# EAGLE design transmitter_with_ST7920_LCD (EAGLE 7.7.0)
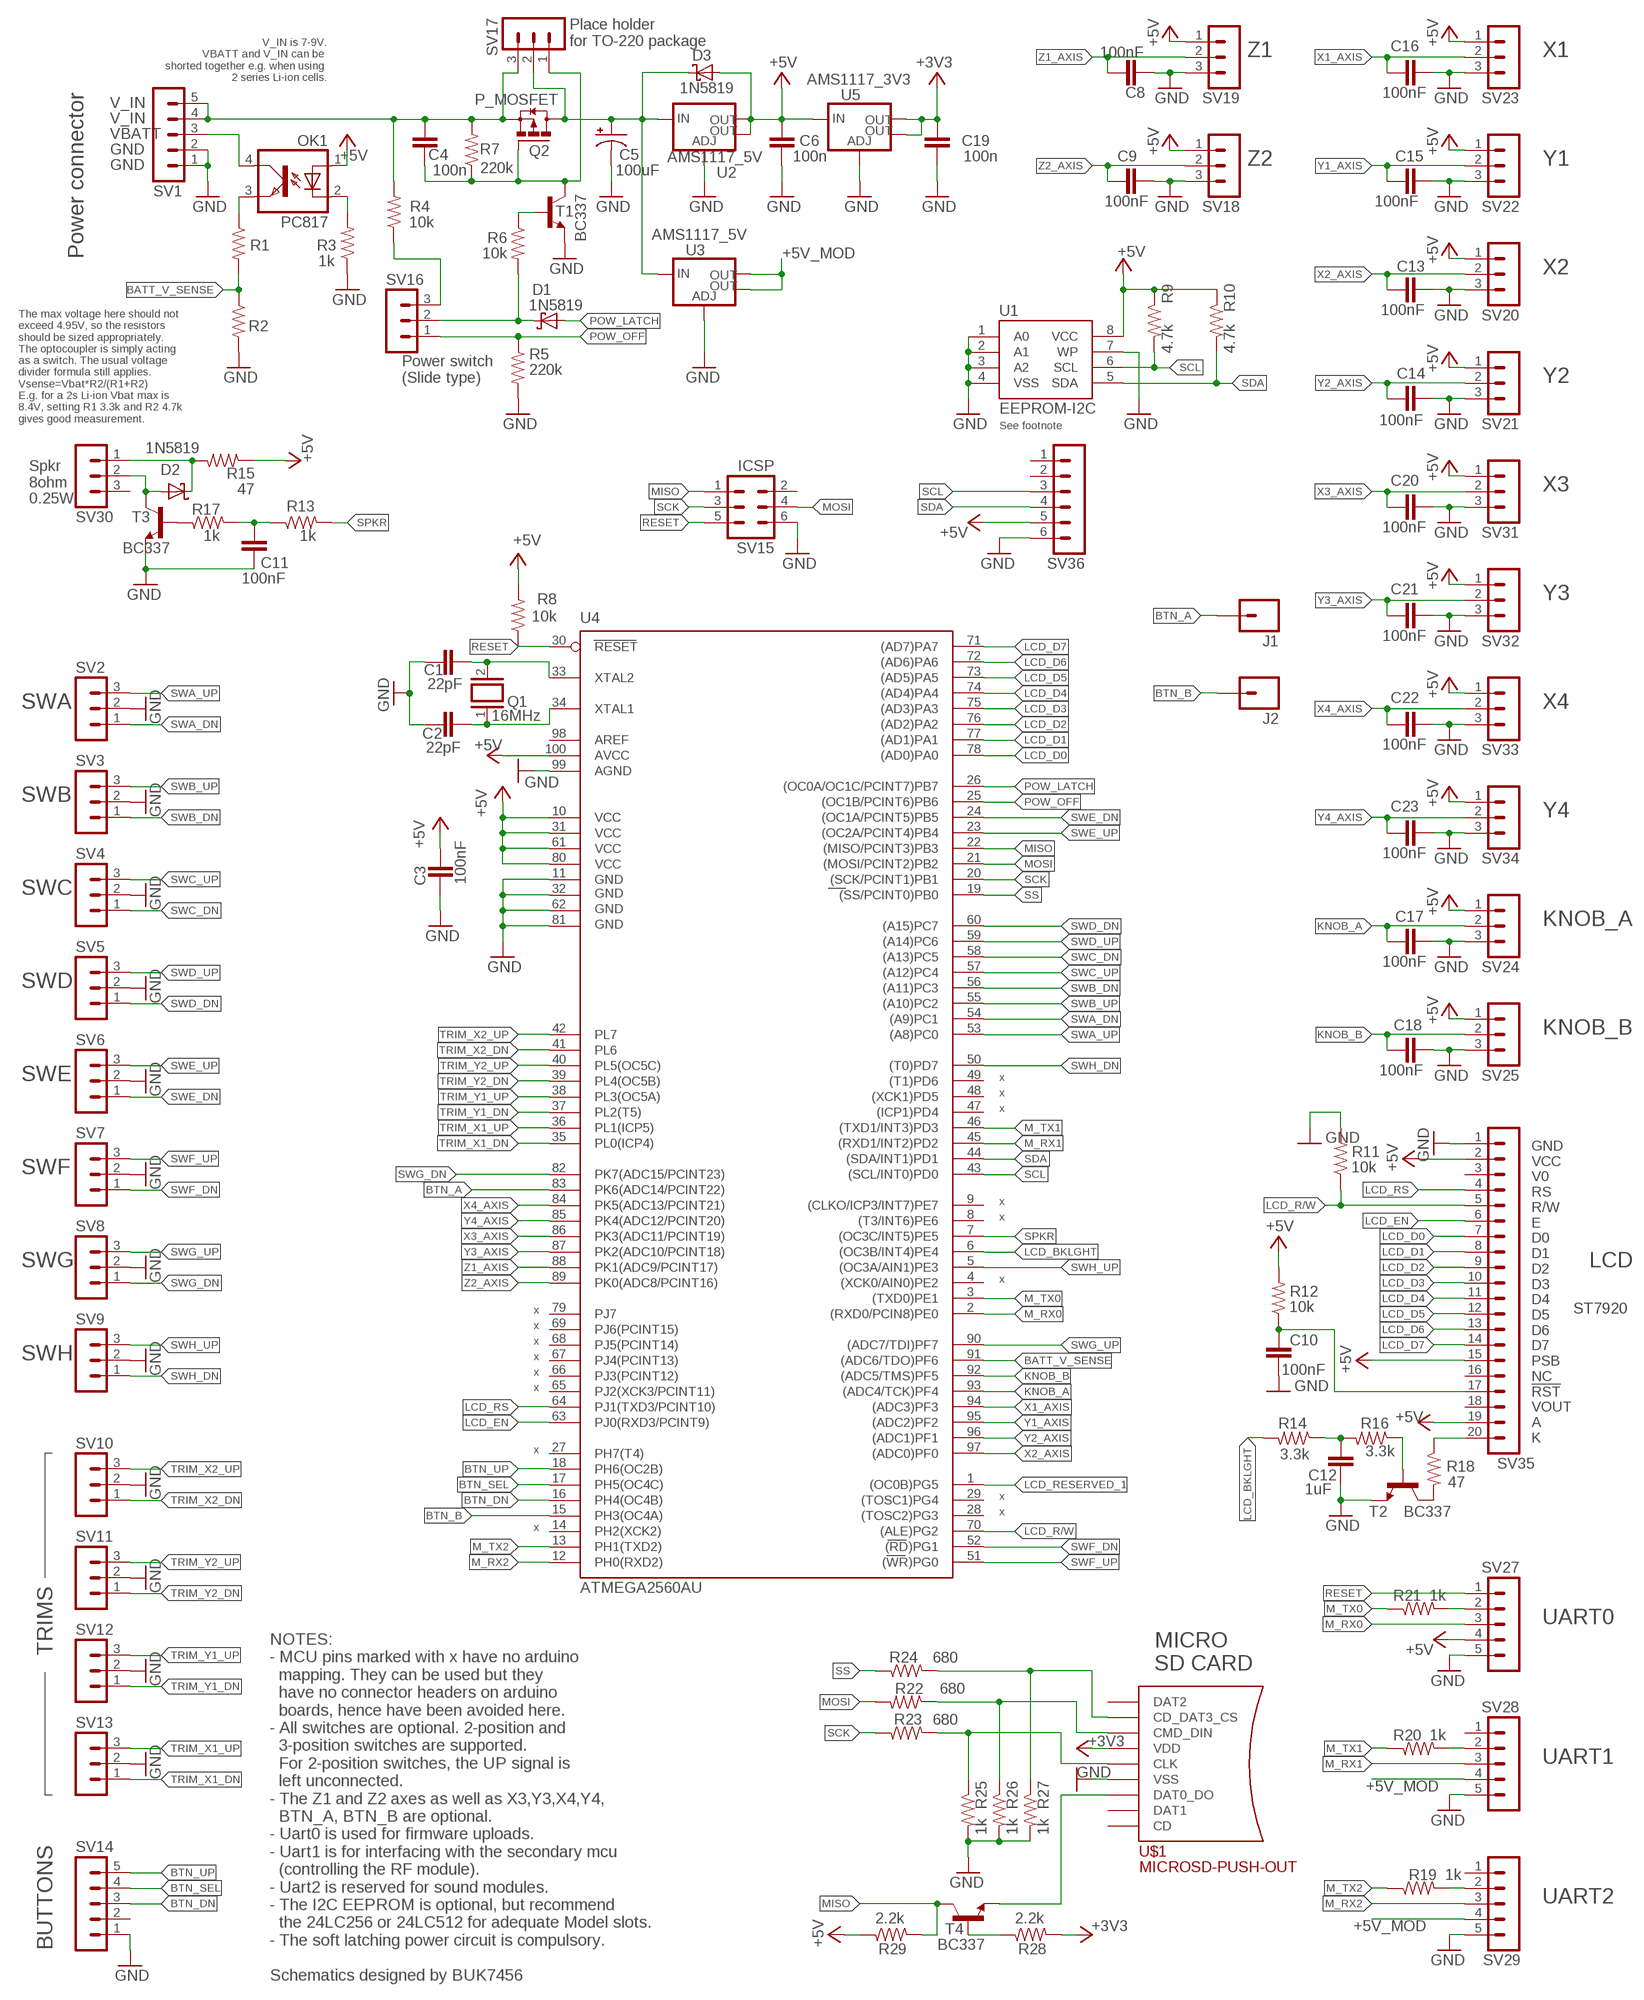
[diagram p0: schematic, sheet 1]

## Parts
C1  22pF  C-EU050-024X044  [C050-024X044]
C2  22pF  C-EU050-024X044  [C050-024X044]
C3  100nF  C-EU050-024X044  [C050-024X044]
C4  100n  C-EU050-024X044  [C050-024X044]
C5  100uF  CPOL-USE2,5-6E  [E2,5-6E]
C6  100n  C-EU050-024X044  [C050-024X044]
C8  100nF  C-EU050-024X044  [C050-024X044]
C9  100nF  C-EU050-024X044  [C050-024X044]
C10  100nF  C-EU050-024X044  [C050-024X044]
C11  100nF  C-EU050-024X044  [C050-024X044]
C12  1uF  C-EU050-024X044  [C050-024X044]
C13  100nF  C-EU050-024X044  [C050-024X044]
C14  100nF  C-EU050-024X044  [C050-024X044]
C15  100nF  C-EU050-024X044  [C050-024X044]
C16  100nF  C-EU050-024X044  [C050-024X044]
C17  100nF  C-EU050-024X044  [C050-024X044]
C18  100nF  C-EU050-024X044  [C050-024X044]
C19  100n  C-EU050-024X044  [C050-024X044]
C20  100nF  C-EU050-024X044  [C050-024X044]
C21  100nF  C-EU050-024X044  [C050-024X044]
C22  100nF  C-EU050-024X044  [C050-024X044]
C23  100nF  C-EU050-024X044  [C050-024X044]
D1  1N5819  1N5817-B  [DO41-7.6]
D2  1N5819  1N5817-B  [DO41-7.6]
D3  1N5819  1N5817-B  [DO41-7.6]
J1  M01PTH_LONGPAD  [1X01_LONGPAD]
J2  M01PTH_LONGPAD  [1X01_LONGPAD]
OK1  PC817  [DIL04]
Q1  16MHz  XTAL/S  [QS]
Q2  P_MOSFET  FDN360P  [SUPER-SOT3]
R1  1k  R-US_0204/5  [0204/5]
R2  1k  R-US_0204/5  [0204/5]
R3  1k  R-US_0204/5  [0204/5]
R4  10k  R-US_0204/5  [0204/5]
R5  220k  R-US_0204/5  [0204/5]
R6  10k  R-US_0204/5  [0204/5]
R7  220k  R-US_0204/5  [0204/5]
R8  10k  R-US_0204/5  [0204/5]
R9  4.7k  R-US_0204/5  [0204/5]
R10  4.7k  R-US_0204/5  [0204/5]
R11  10k  R-US_0204/5  [0204/5]
R12  10k  R-US_0204/5  [0204/5]
R13  1k  R-US_0204/5  [0204/5]
R14  3.3k  R-US_0204/5  [0204/5]
R15  47  R-US_0204/5  [0204/5]
R16  3.3k  R-US_0204/5  [0204/5]
R17  1k  R-US_0204/5  [0204/5]
R18  47  R-US_0204/5  [0204/5]
R19  1k  R-US_0204/5  [0204/5]
R20  1k  R-US_0204/5  [0204/5]
R21  1k  R-US_0204/5  [0204/5]
R22  680  R-US_0204/5  [0204/5]
R23  680  R-US_0204/5  [0204/5]
R24  680  R-US_0204/5  [0204/5]
R25  1k  R-US_0204/5  [0204/5]
R26  1k  R-US_0204/5  [0204/5]
R27  1k  R-US_0204/5  [0204/5]
R28  2.2k  R-US_0204/5  [0204/5]
R29  2.2k  R-US_0204/5  [0204/5]
SV1  MA05-1  [MA05-1]
SV2  MA03-1  [MA03-1]
SV3  MA03-1  [MA03-1]
SV4  MA03-1  [MA03-1]
SV5  MA03-1  [MA03-1]
SV6  MA03-1  [MA03-1]
SV7  MA03-1  [MA03-1]
SV8  MA03-1  [MA03-1]
SV9  MA03-1  [MA03-1]
SV10  MA03-1  [MA03-1]
SV11  MA03-1  [MA03-1]
SV12  MA03-1  [MA03-1]
SV13  MA03-1  [MA03-1]
SV14  MA05-1  [MA05-1]
SV15  ICSP  MA03-2  [MA03-2]
SV16  MA03-1  [MA03-1]
SV17  MA03-1  [MA03-1]
SV18  MA03-1  [MA03-1]
SV19  MA03-1  [MA03-1]
SV20  MA03-1  [MA03-1]
SV21  MA03-1  [MA03-1]
SV22  MA03-1  [MA03-1]
SV23  MA03-1  [MA03-1]
SV24  MA03-1  [MA03-1]
SV25  MA03-1  [MA03-1]
SV27  MA05-1  [MA05-1]
SV28  MA05-1  [MA05-1]
SV29  MA05-1  [MA05-1]
SV30  MA03-1  [MA03-1]
SV31  MA03-1  [MA03-1]
SV32  MA03-1  [MA03-1]
SV33  MA03-1  [MA03-1]
SV34  MA03-1  [MA03-1]
SV35  MA20-1  [MA20-1]
SV36  MA06-1  [MA06-1]
T1  BC337  [TO92]
T2  BC337  [TO92]
T3  BC337  [TO92]
T4  BC337  [TO92]
U1  EEPROM-I2C  EEPROM-I2CEIAJ  [SO08-EIAJ]
U2  AMS1117_5V  V_REG_LM1117SOT223  [SOT223]
U3  AMS1117_5V  V_REG_LM1117SOT223  [SOT223]
U4  ATMEGA2560AU  [TQFP100]
U5  AMS1117_3V3  V_REG_LM1117SOT223  [SOT223]
U$1  MICROSD-PUSH-OUT  [MICROSD-PUSH-OUT]

## Nets
+3V3: C19.2 R28.2 U5.2(OUT) U5.4(OUT) U$1.4(VDD)
+5V: C3.1 C6.2 D3.A OK1.1(A) R8.2 R9.1 R10.1 R12.2 R15.1 R29.1 SV18.1 SV19.1 SV20.1 SV21.1 SV22.1 SV23.1 SV24.1 SV25.1 SV27.4 SV31.1 SV32.1 SV33.1 SV34.1 SV35.2 SV35.15 SV35.19 SV36.5 U1.8(VCC) U2.2(OUT) U2.4(OUT) U4.10(VCC) U4.31(VCC1) U4.61(VCC2) U4.80(VCC3) U4.100(AVCC) U5.3(IN)
+5V_MOD: SV28.4 SV29.4 U3.2(OUT) U3.4(OUT)
BATT_V_SENSE: R1.2 R2.1 U4.91((ADC6/TDO)PF6)
BTN_A: J1.1 U4.83(PK6(ADC14/PCINT22))
BTN_B: J2.1 U4.15(PH3(OC4A))
BTN_DN: SV14.3 U4.16(PH4(OC4B))
BTN_SEL: SV14.4 U4.17(PH5(OC4C))
BTN_UP: SV14.5 U4.18(PH6(OC2B))
GND: C1.1 C2.1 C3.2 C5.- C6.1 C8.2 C9.1 C10.2 C11.2 C12.2 C13.1 C14.1 C15.1 C16.1 C17.1 C18.1 C19.1 C20.1 C21.1 C22.1 C23.1 R2.2 R3.1 R5.2 R11.2 R25.2 R26.2 R27.2 SV1.1 SV1.2 SV2.2 SV3.2 SV4.2 SV5.2 SV6.2 SV7.2 SV8.2 SV9.2 SV10.2 SV11.2 SV12.2 SV13.2 SV14.1 SV15.6 SV18.3 SV19.3 SV20.3 SV21.3 SV22.3 SV23.3 SV24.3 SV25.3 SV27.5 SV28.5 SV29.5 SV31.3 SV32.3 SV33.3 SV34.3 SV35.1 SV36.6 T1.1(E) T2.1(E) T3.1(E) U1.1(A0) U1.2(A1) U1.3(A2) U1.4(VSS) U1.7(WP) U2.1(ADJ) U3.1(ADJ) U4.11(GND) U4.32(GND1) U4.62(GND2) U4.81(GND3) U4.99(AGND) U5.1(ADJ) U$1.6(VSS) U$1.G1(VSS) U$1.G2(VSS) U$1.G3(VSS) U$1.G4(VSS)
KNOB_A: C17.2 SV24.2 U4.93((ADC4/TCK)PF4)
KNOB_B: C18.2 SV25.2 U4.92((ADC5/TMS)PF5)
LCD_BKLGHT: R14.2 U4.6((OC3B/INT4)PE4)
LCD_D0: SV35.7 U4.78((AD0)PA0)
LCD_D1: SV35.8 U4.77((AD1)PA1)
LCD_D2: SV35.9 U4.76((AD2)PA2)
LCD_D3: SV35.10 U4.75((AD3)PA3)
LCD_D4: SV35.11 U4.74((AD4)PA4)
LCD_D5: SV35.12 U4.73((AD5)PA5)
LCD_D6: SV35.13 U4.72((AD6)PA6)
LCD_D7: SV35.14 U4.71((AD7)PA7)
LCD_EN: SV35.6 U4.63(PJ0(RXD3/PCINT9))
LCD_R/W: R11.1 SV35.5 U4.70((ALE)PG2)
LCD_RESERVED_1: U4.1((OC0B)PG5)
LCD_RS: SV35.4 U4.64(PJ1(TXD3/PCINT10))
M_RX0: SV27.3 U4.2((RXD0/PCIN8)PE0)
M_RX1: SV28.3 U4.45((RXD1/INT2)PD2)
M_RX2: SV29.3 U4.12(PH0(RXD2))
M_TX0: R21.1 U4.3((TXD0)PE1)
M_TX1: R20.1 U4.46((TXD1/INT3)PD3)
M_TX2: R19.1 U4.13(PH1(TXD2))
MISO: R29.2 SV15.1 T4.3(C) U4.22((MISO/PCINT3)PB3)
MOSI: R22.2 SV15.4 U4.21((MOSI/PCINT2)PB2)
N$1: C12.1 R14.1 R16.2
N$2: C10.1 R12.1 SV35.17
N$3: R18.2 T2.3(C)
N$4: R16.1 T2.2(B)
N$5: C11.1 R13.1 R17.2
N$6: R21.2 SV27.2
N$7: R20.2 SV28.2
N$8: R19.2 SV29.2
N$9: C1.2 Q1.2 U4.33(XTAL2)
N$10: C2.2 Q1.1 U4.34(XTAL1)
N$11: T4.1(E) U$1.7(DAT0_DO)
N$12: OK1.4(COL) SV1.3
N$15: R18.1 SV35.20
N$16: R24.2 R27.1 U$1.2(CD_DAT3_CS)
N$17: R22.1 R26.1 U$1.3(CMD_DIN)
N$18: R23.2 R25.1 U$1.5(CLK)
N$19: R28.1 T4.2(B)
N$20: R17.1 T3.2(B)
N$21: D2.A SV30.2 T3.3(C)
N$22: D2.C R15.2 SV30.1
N$29: R6.1 T1.2(B)
N$30: D1.C R6.2 SV16.2
N$38: OK1.3(EMIT) R1.1
N$39: C4.2 Q2.2(S) R4.2 R7.2 SV1.4 SV1.5 SV17.3
N$43: C4.1 Q2.1(G) R7.1 SV17.1 T1.3(C)
N$44: OK1.2(C) R3.2
N$45: R4.1 SV16.3
N$47: C5.+ D3.C Q2.3(D) SV17.2 U2.3(IN) U3.3(IN)
POW_LATCH: D1.A U4.26((OC0A/OC1C/PCINT7)PB7)
POW_OFF: R5.1 SV16.1 U4.25((OC1B/PCINT6)PB6)
RESET: R8.1 SV15.5 SV27.1 U4.30(RESET)
SCK: R23.1 SV15.3 U4.20((SCK/PCINT1)PB1)
SCL: R9.2 SV36.3 U1.6(SCL) U4.43((SCL/INT0)PD0)
SDA: R10.2 SV36.4 U1.5(SDA) U4.44((SDA/INT1)PD1)
SPKR: R13.2 U4.7((OC3C/INT5)PE5)
SS: R24.1 U4.19((SS/PCINT0)PB0)
SWA_DN: SV2.1 U4.54((A9)PC1)
SWA_UP: SV2.3 U4.53((A8)PC0)
SWB_DN: SV3.1 U4.56((A11)PC3)
SWB_UP: SV3.3 U4.55((A10)PC2)
SWC_DN: SV4.1 U4.58((A13)PC5)
SWC_UP: SV4.3 U4.57((A12)PC4)
SWD_DN: SV5.1 U4.60((A15)PC7)
SWD_UP: SV5.3 U4.59((A14)PC6)
SWE_DN: SV6.1 U4.24((OC1A/PCINT5)PB5)
SWE_UP: SV6.3 U4.23((OC2A/PCINT4)PB4)
SWF_DN: SV7.1 U4.52((RD)PG1)
SWF_UP: SV7.3 U4.51((WR)PG0)
SWG_DN: SV8.1 U4.82(PK7(ADC15/PCINT23))
SWG_UP: SV8.3 U4.90((ADC7/TDI)PF7)
SWH_DN: SV9.1 U4.50((T0)PD7)
SWH_UP: SV9.3 U4.5((OC3A/AIN1)PE3)
TRIM_X1_DN: SV13.1 U4.35(PL0(ICP4))
TRIM_X1_UP: SV13.3 U4.36(PL1(ICP5))
TRIM_X2_DN: SV10.1 U4.41(PL6)
TRIM_X2_UP: SV10.3 U4.42(PL7)
TRIM_Y1_DN: SV12.1 U4.37(PL2(T5))
TRIM_Y1_UP: SV12.3 U4.38(PL3(OC5A))
TRIM_Y2_DN: SV11.1 U4.39(PL4(OC5B))
TRIM_Y2_UP: SV11.3 U4.40(PL5(OC5C))
X1_AXIS: C16.2 SV23.2 U4.94((ADC3)PF3)
X2_AXIS: C13.2 SV20.2 U4.97((ADC0)PF0)
X3_AXIS: C20.2 SV31.2 U4.86(PK3(ADC11/PCINT19))
X4_AXIS: C22.2 SV33.2 U4.84(PK5(ADC13/PCINT21))
Y1_AXIS: C15.2 SV22.2 U4.95((ADC2)PF2)
Y2_AXIS: C14.2 SV21.2 U4.96((ADC1)PF1)
Y3_AXIS: C21.2 SV32.2 U4.87(PK2(ADC10/PCINT18))
Y4_AXIS: C23.2 SV34.2 U4.85(PK4(ADC12/PCINT20))
Z1_AXIS: C8.1 SV19.2 U4.88(PK1(ADC9/PCINT17))
Z2_AXIS: C9.2 SV18.2 U4.89(PK0(ADC8/PCINT16))
Unconnected: SV14.2 SV15.2 SV28.1 SV29.1 SV30.3 SV35.3 SV35.16 SV35.18 SV36.1 SV36.2 U4.4((XCK0/AIN0)PE2) U4.8((T3/INT6)PE6) U4.9((CLKO/ICP3/INT7)PE7) U4.14(PH2(XCK2)) U4.27(PH7(T4)) U4.28((TOSC2)PG3) U4.29((TOSC1)PG4) U4.47((ICP1)PD4) U4.48((XCK1)PD5) U4.49((T1)PD6) U4.65(PJ2(XCK3/PCINT11)) U4.66(PJ3(PCINT12)) U4.67(PJ4(PCINT13)) U4.68(PJ5(PCINT14)) U4.69(PJ6(PCINT15)) U4.79(PJ7) U4.98(AREF) U$1.1(DAT2) U$1.8(DAT1) U$1.CD

## Notes on the sheet
- V_IN is 7-9V.
  VBATT and V_IN can be 
  shorted together e.g. when using 
  2 series Li-ion cells.
- Place holder
  for TO-220 package
- Z1 | X1
- V_IN
- V_IN
- VBATT
- GND
- Z2 | Y1
- GND
- Power connector
- X2
- Power switch
  (Slide type)
- Y2
- See footnote
- The max voltage here should not 
  exceed 4.95V, so the resistors
  should be sized appropriately.
  The optocoupler is simply acting
  as a switch. The usual voltage 
  divider formula still applies.
  Vsense=Vbat*R2/(R1+R2)
  E.g. for a 2s Li-ion Vbat max is
  8.4V, setting R1 3.3k and R2 4.7k
  gives good measurement.
- Spkr
  8ohm 
  0.25W
- X3
- Y3
- SWA | X4
- SWB
- Y4
- SWC
- KNOB_A
- SWD
- KNOB_B
- SWE | x
- x
- x
- SWF
- x
- x
- SWG | LCD
- x
- x | ST7920
- x
- x
- SWH | x
- x
- x
- GND
  VCC
  V0
  RS
  R/W
  E
  D0
  D1
  D2
  D3
  D4
  D5
  D6
  D7
  PSB
  NC
  !RST
  VOUT
  A
  K
- x
- x
- x
- x
- UART0
- TRIMS
- MICRO 
  SD CARD
- UART1
- UART2
- BUTTONS
- NOTES:
  - MCU pins marked with x have no arduino
    mapping. They can be used but they
    have no connector headers on arduino
    boards, hence have been avoided here.
  - All switches are optional. 2-position and 
    3-position switches are supported. 
    For 2-position switches, the UP signal is 
    left unconnected.
  - The Z1 and Z2 axes as well as X3,Y3,X4,Y4, 
    BTN_A, BTN_B are optional.
  - Uart0 is used for firmware uploads.
  - Uart1 is for interfacing with the secondary mcu 
    (controlling the RF module).
  - Uart2 is reserved for sound modules.
  - The I2C EEPROM is optional, but recommend 
    the 24LC256 or 24LC512 for adequate Model slots.
  - The soft latching power circuit is compulsory.
  
  Schematics designed by BUK7456

## Library data of the parts
C1-C4 C6 C8-C23 = rcl:C-EU: CAPACITOR, European symbol
C5 = rcl:CPOL-US: POLARIZED CAPACITOR, American symbol
D1-D3 = diode:1N581*: 1.0A SCHOTTKY BARRIER RECTIFIER Source: http://www.diodes.com/datasheets/ds23001.pdf
J1 J2 = SparkFun-Connectors:M01: Header 1 Standard 1-pin 0.1" header. Use with straight break away headers (SKU : PRT-00116), right angle break away headers (PRT-00553), swiss pins (PRT-00743), machine pins (PRT-00117), and female headers (PRT-00115). SMTSO-256-ET is a "flush mount" nut for a 4-40 screw. The older package used to be too tight, and did not allow it to sit properly thru the drill hit. The latest (0.165DIA) fits nice and snug.
OK1 = optocoupler:PC817: SHARP OPTO COUPLER; MPN: PC817X4J000F; OC_FARNELL: 9707727; OC_NEWARK: 97K7059
Q1 = special:XTAL/S: CRYSTAL
Q2 = transistor-power:FDN360P: Single P-Channel, PowerTrench (R) MOSFET Source: http://www.fairchildsemi.com/ds/FD/FDN360P.pdf
R1-R10 R13-R29 = rcl:R-US_: RESISTOR, American symbol
R11 R12 = resistor:R-US_: RESISTOR, American symbol
SV1 SV14 SV27-SV29 = con-lstb:MA05-1: PIN HEADER; OC_FARNELL: unknown; OC_NEWARK: unknown
SV2-SV13 SV16-SV25 SV30-SV34 = con-lstb:MA03-1: PIN HEADER; OC_FARNELL: unknown; OC_NEWARK: unknown
SV15 = con-lstb:MA03-2: PIN HEADER; OC_FARNELL: unknown; OC_NEWARK: unknown
SV35 = con-lstb:MA20-1: PIN HEADER; OC_FARNELL: unknown; OC_NEWARK: unknown
SV36 = con-lstb:MA06-1: PIN HEADER; OC_FARNELL: unknown; OC_NEWARK: unknown
T1-T4 = transistor:BC337: NPN TRANSISTOR
U1 = SparkFun-DigitalIC:EEPROM-I2C: I2C EEPROM chips, 24LC256 (and others)
U2 U3 U5 = SparkFun-PowerIC:V_REG_LM1117: Voltage Regulator LM1117 Standard adjustable voltage regulator but in SMD form. Spark Fun Electronics SKU : COM-00595; PROD_ID: VREG-08170
U4 = SparkFun-DigitalIC:ATMEGA2560: Atmel 100-pin 8-bit uC 64/128/256 Kbytes FLASH 4 Kbytes EEPROM 8 Kbytes SRAM 86 General Purpose I/O pins 12-channels16-bit PWM 4 x Serial USARTs 16-channels 10-bit A/D; PROD_ID: IC-10040
U$1 = microsd:MICROSD-PUSH-OUT: T-Flash Push-Out Micro SD Card Reader 14.75mm x 14.5mm SMD with external pins

## Board
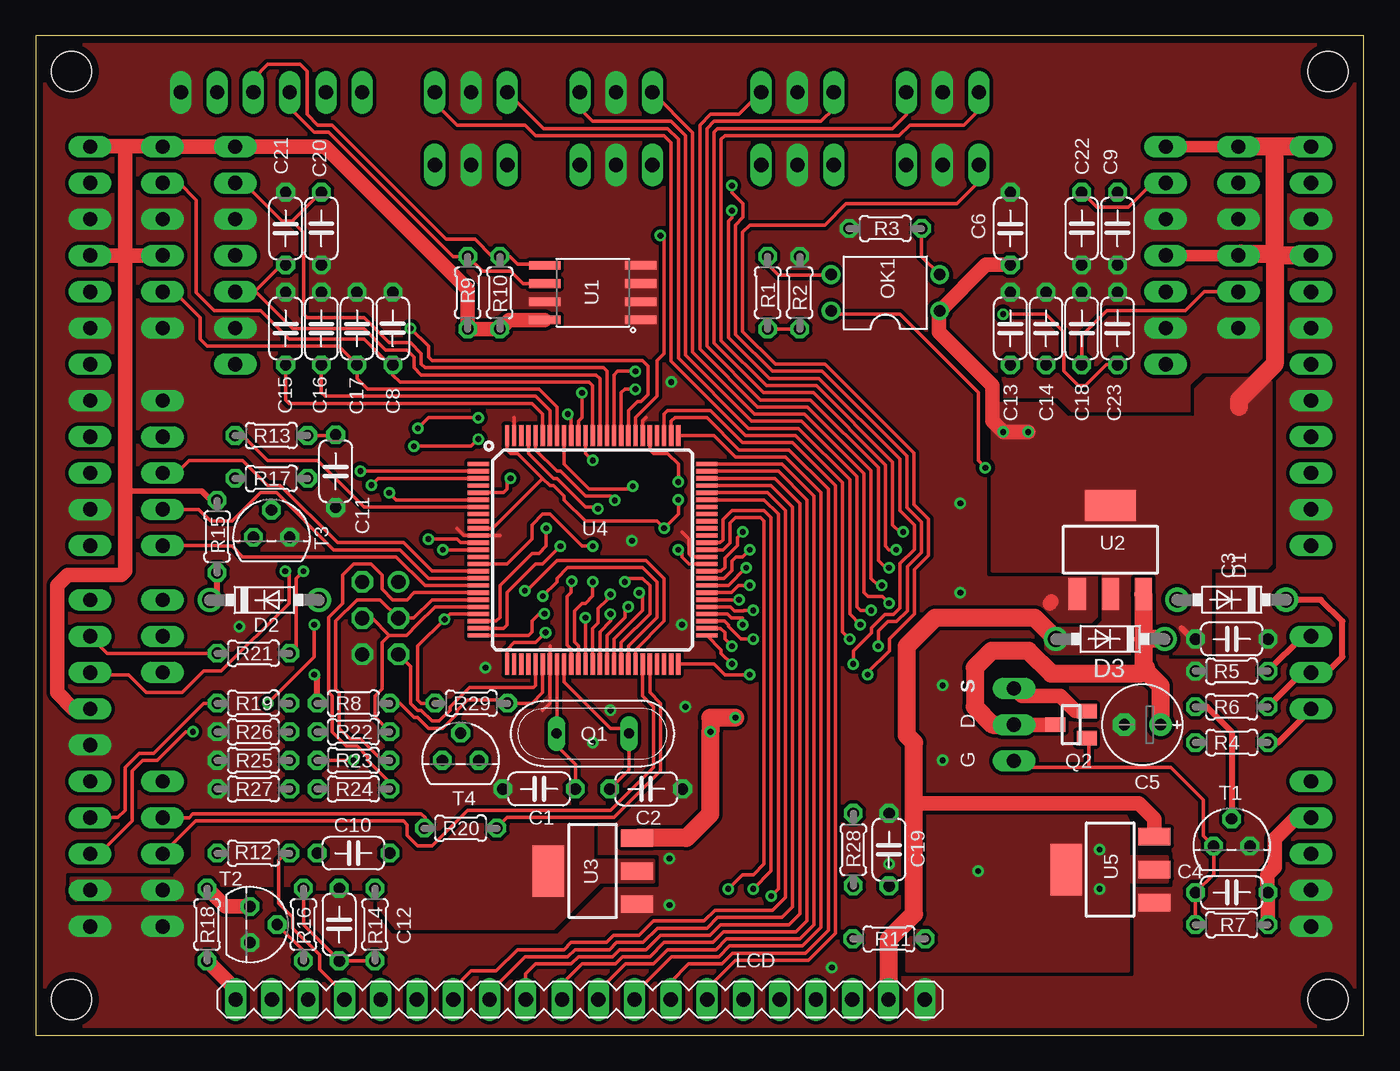
[diagram p1: board, top side]
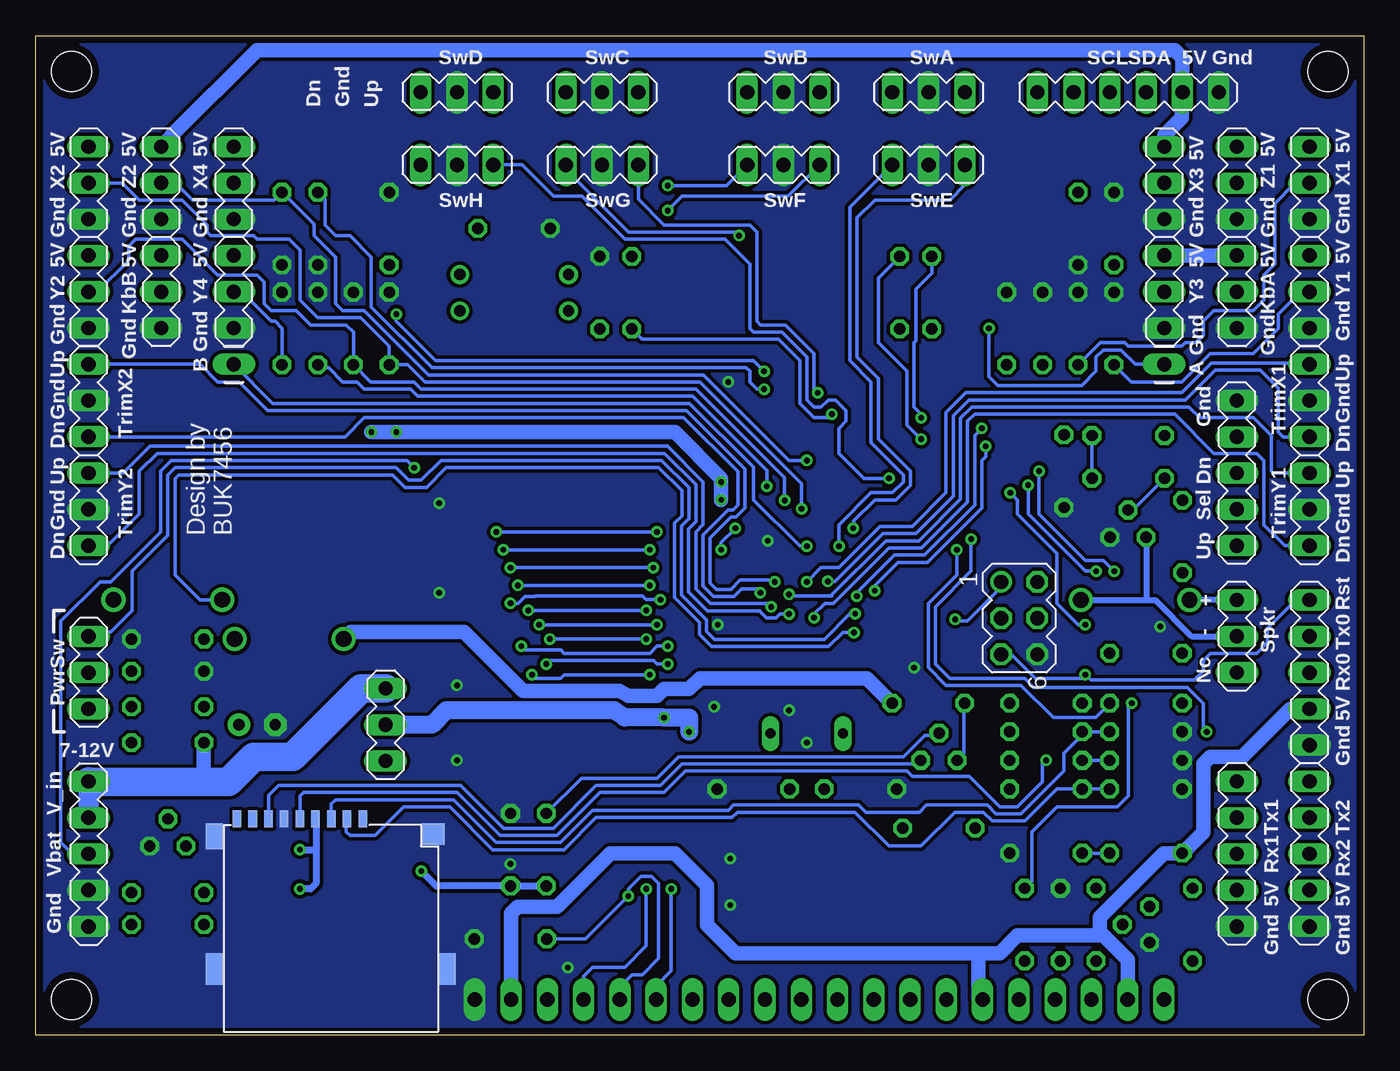
[diagram p2: board, bottom side, seen from below]

Size 93 x 70 mm. Coordinates in mm from the lower left corner, seen from the top.
Outline: 0,0 93,0 93,70 0,70 0,0
Copper layers (1*16): Top 0.035mm / dielectric 1.5mm / Bottom 0.035mm
Design rules "default *": minimum track width 0.25mm, minimum drill 0.4mm, track to track 0.25mm, track to pad 0.25mm, pad to pad 0.25mm, via to via 0.25mm, smd to smd 0.25mm, copper to edge 0.5mm, drill to drill 8mil, minimum pad ring 10mil, minimum via ring 8mil, stop-mask expansion 4mil, vias tented up to drill 0.8mm, thermal gap 10mil
Holes 2.8 mm at 2.5,2.5 90.5,2.5 2.5,67.5 90.5,67.5

### Footprints (pad centres in the part's own frame; a part is rotated, then mirrored left to right if it is on the bottom)
C050-024X044 = drill 0.8 octagon: 1 -2.54,0; 2 2.54,0
E2,5-6E = drill 0.8 pad 1.575: + -1.27,0 | drill 0.8 pad 1.575 octagon: - 1.27,0
DO41-7.6 = drill 1.1 pad 1.7: A 3.81,0; C -3.81,0
1X01_LONGPAD = drill 1 long: 1 0,0
DIL04 = drill 0.8: 1 -1.27,-3.81; 2 1.27,-3.81; 3 1.27,3.81; 4 -1.27,3.81
QS = drill 0.7 pad 1.016 long: 1 -2.54,0; 2 2.54,0
SUPER-SOT3 = smd 1 x 1.4: 1 -0.95,-1.1; 2 0.95,-1.1; 3 0,1.1
0204/5 = drill 0.8 octagon: 1 -2.54,0; 2 2.54,0
MA05-1 = drill 1 long: 1 -5.08,0; 2 -2.54,0; 3 0,0; 4 2.54,0; 5 5.08,0
MA03-1 = drill 1 long: 1 -2.54,0; 2 0,0; 3 2.54,0
MA03-2 = drill 1: 1 -2.54,-1.27 | drill 1 octagon: 2 -2.54,1.27; 3 0,-1.27; 4 0,1.27; 5 2.54,-1.27; 6 2.54,1.27
MA20-1 = drill 1 long: 1 -24.13,0; 2 -21.59,0; 3 -19.05,0; 4 -16.51,0; 5 -13.97,0; 6 -11.43,0; 7 -8.89,0; 8 -6.35,0; 9 -3.81,0; 10 -1.27,0; 11 1.27,0; 12 3.81,0; 13 6.35,0; 14 8.89,0; 15 11.43,0; 16 13.97,0; 17 16.51,0; 18 19.05,0; 19 21.59,0; 20 24.13,0
MA06-1 = drill 1 long: 1 -6.35,0; 2 -3.81,0; 3 -1.27,0; 4 1.27,0; 5 3.81,0; 6 6.35,0
TO92 = drill 0.8 octagon: 1 1.27,0; 2 0,1.905; 3 -1.27,0
SO08-EIAJ = smd 0.61 x 2.21: 1 -1.905,-3.378; 2 -0.635,-3.378; 3 0.635,-3.378; 4 1.905,-3.378; 5 1.905,3.353; 6 0.635,3.353; 7 -0.635,3.353; 8 -1.905,3.353
SOT223 = smd 1.219 x 2.235: 1 -2.311,-3.099; 2 0,-3.099; 3 2.311,-3.099 | smd 3.6 x 2.2: 4 0,3.099
TQFP100 = smd 1.5 x 0.3: 1 -8,6; 2 -8,5.5; 3 -8,5; 4 -8,4.5; 5 -8,4; 6 -8,3.5; 7 -8,3; 8 -8,2.5; 9 -8,2; 10 -8,1.5; 11 -8,1; 12 -8,0.5; 13 -8,0; 14 -8,-0.5; 15 -8,-1; 16 -8,-1.5; 17 -8,-2; 18 -8,-2.5; 19 -8,-3; 20 -8,-3.5; 21 -8,-4; 22 -8,-4.5; 23 -8,-5; 24 -8,-5.5; 25 -8,-6; 51 8,-6; 52 8,-5.5; 53 8,-5; 54 8,-4.5; 55 8,-4; 56 8,-3.5; 57 8,-3; 58 8,-2.5; 59 8,-2; 60 8,-1.5; 61 8,-1; 62 8,-0.5; 63 8,0; 64 8,0.5; 65 8,1; 66 8,1.5; 67 8,2; 68 8,2.5; 69 8,3; 70 8,3.5; 71 8,4; 72 8,4.5; 73 8,5; 74 8,5.5; 75 8,6 | smd 0.3 x 1.5: 26 -6,-8; 27 -5.5,-8; 28 -5,-8; 29 -4.5,-8; 30 -4,-8; 31 -3.5,-8; 32 -3,-8; 33 -2.5,-8; 34 -2,-8; 35 -1.5,-8; 36 -1,-8; 37 -0.5,-8; 38 0,-8; 39 0.5,-8; 40 1,-8; 41 1.5,-8; 42 2,-8; 43 2.5,-8; 44 3,-8; 45 3.5,-8; 46 4,-8; 47 4.5,-8; 48 5,-8; 49 5.5,-8; 50 6,-8; 76 6,8; 77 5.5,8; 78 5,8; 79 4.5,8; 80 4,8; 81 3.5,8; 82 3,8; 83 2.5,8; 84 2,8; 85 1.5,8; 86 1,8; 87 0.5,8; 88 0,8; 89 -0.5,8; 90 -1,8; 91 -1.5,8; 92 -2,8; 93 -2.5,8; 94 -3,8; 95 -3.5,8; 96 -4,8; 97 -4.5,8; 98 -5,8; 99 -5.5,8; 100 -6,8
MICROSD-PUSH-OUT = smd 0.6 x 1.2: 1 9.625,0.425; 2 8.525,0.425; 3 7.425,0.425; 4 6.325,0.425; 5 5.225,0.425; 6 4.125,0.425; 7 3.025,0.425; 8 1.925,0.425; CD 0.825,0.425 | smd 1.2 x 1.8: G1 -0.775,-0.8 | smd 1.2 x 2.2: G2 -0.775,-10.1; G4 15.525,-10.1 | smd 1.6 x 1.5: G3 14.55,-0.65

### Placement (x,y rotation side)
C1  35.25,17.25 0 top
C2  42.75,17.25 180 top
C3  83.75,27.75 0 top
C4  83.75,10 0 top
C5  77.5,21.75 180 top
C6  68.25,56.5 270 top
C8  25,49.5 90 top
C9  75.75,56.5 90 top
C10  22.25,12.75 0 top
C11  21,39.5 270 top
C12  21.25,7.75 90 top
C13  68.25,49.5 270 top
C14  70.75,49.5 270 top
C15  17.5,49.5 270 top
C16  20,49.5 270 top
C17  22.5,49.5 270 top
C18  73.25,49.5 270 top
C19  59.75,13 270 top
C20  20,56.5 90 top
C21  17.5,56.5 270 top
C22  73.25,56.5 90 top
C23  75.75,49.5 270 top
D1  83.75,30.5 180 top
D2  16.01,30.48 0 top
D3  75.25,27.75 180 top
J1  13.97,46.99 90 bottom
J2  79.14,46.99 90 bottom
OK1  59.5,52 90 top
Q1  39,21.12 180 top
Q2  72.5,21.75 90 top
R1  51.25,52 270 top
R2  53.5,52 90 top
R3  59.5,56.5 0 top
R4  83.75,20.5 180 top
R5  83.75,25.5 180 top
R6  83.75,23 0 top
R7  83.75,7.75 0 top
R8  22.25,23.25 0 top
R9  30.25,52 90 top
R10  32.5,52 90 top
R11  59.75,6.75 0 top
R12  15.25,12.75 180 top
R13  16.5,42 180 top
R14  23.75,7.75 90 top
R15  12.7,34.92 270 top
R16  18.75,7.75 90 top
R17  16.5,39 0 top
R18  12,7.75 90 top
R19  15.25,23.25 180 top
R20  29.75,14.5 180 top
R21  15.25,26.75 180 top
R22  22.25,21.25 0 top
R23  22.25,19.25 180 top
R24  22.25,17.25 180 top
R25  15.25,19.25 180 top
R26  15.25,21.25 180 top
R27  15.25,17.25 180 top
R28  57.25,13 270 top
R29  30.5,23.25 180 top
SV1  89.3,12.7 90 bottom
SV2  30.48,66.04 0 bottom
SV3  40.64,66.04 0 bottom
SV4  53.34,66.04 0 bottom
SV5  63.5,66.04 0 bottom
SV6  30.48,60.96 0 bottom
SV7  40.64,60.96 0 bottom
SV8  53.34,60.96 0 bottom
SV9  63.5,60.96 0 bottom
SV10  89.3,44.45 90 bottom
SV11  89.3,36.83 90 bottom
SV12  3.81,36.83 90 bottom
SV13  3.81,44.45 90 bottom
SV14  8.89,39.37 270 bottom
SV15  24.13,29.21 270 bottom
SV16  89.3,25.4 270 bottom
SV17  68.5,21.75 90 bottom
SV18  84.22,59.69 270 bottom
SV19  8.89,59.69 270 bottom
SV20  89.3,59.69 270 bottom
SV21  89.3,52.07 270 bottom
SV22  3.81,52.07 270 bottom
SV23  3.81,59.69 270 bottom
SV24  8.89,52.07 270 bottom
SV25  84.22,52.07 270 bottom
SV27  3.81,25.4 270 bottom
SV28  8.89,12.7 270 bottom
SV29  3.81,12.7 270 bottom
SV30  8.89,27.94 270 bottom
SV31  13.97,59.69 270 bottom
SV32  13.97,52.07 270 bottom
SV33  79.14,59.69 270 bottom
SV34  79.14,52.07 270 bottom
SV35  38.12,2.5 180 top
SV36  16.51,66.04 0 bottom
T1  83.75,13.25 0 top
T2  15,7.75 270 top
T3  16.51,34.88 0 top
T4  29.75,19.25 0 top
U1  39,52 90 top
U2  75.25,34 0 top
U3  39,11.5 90 top
U4  39,34 0 top
U5  75.24,11.6 90 top
U$1  79.73,14.73 0 bottom

### Tracks (layer width: path | path; a pad name or v marks a point on that pad's centre or on a via)
+3V3  (via drill 0.4)
  Bottom 0.5: v74.5,13 73.38,13 | U$1.4 73.38,15.12 73.38,13 | 73.38,13 73.38,10.62 73.75,10.25 v74.5,10.25 | R28.2 C19.2 64.96,10.46 v66,11.5
  pour Top (isolate 0.25, no thermals): 79.25,12.5 76.5,12.5 76.5,15 76.25,15.5 61,15.5 61,4.5 76.5,4.5 76.5,10.75 79.25,10.75
+5V  (via drill 0.4)
  Top 0.25: 35.5,39 36,38.5 36.25,38.5 37,37.75 37,37.5 38.5,36 43.5,36 v44,35.5 45,36.5 v45,37.5 | 35.5,39 33.75,40.75 33.25,40.75 33,41 U4.100 | U4.31 35.5,24 34.75,23.25 R29.1 32.79,23.5 30.25,23.5 29.5,22.75 29.5,22.5 28.5,21.5 27.5,21.5 26.75,22.25 26.5,22.25 25.5,23.25 R8.2 24.79,23.21 | U4.80 43,41 43.25,40.75 44.25,40.75 45,40 v45,38.75 | v45,34 45.25,33.75 45.25,33.5 45.75,33 U4.61 | U4.10 32,35.5 35.5,39
  Top 0.4: R15.1 12.29,37.47 11.62,38.12 6.25,38.12
  Top 0.406: C3.1 81,27.75 80.25,28.5
  Top 0.813: SV34.1 SV25.1 | 79.11,62.25 SV33.1 SV18.1
  Top 1: SV27.4 2.64,22.86 1.5,24 1.5,31.5 2.25,32.25 6,32.25 6.25,32.5 6.25,38.12 6.25,54.5 | 6.25,54.5 6.25,62.25 | 6.25,62.25 8.87,62.25 SV19.1 SV31.1 20.27,62.23 30.25,52.25 R9.1 R10.1 33.13,50.09 U1.8 | 6.25,62.25 3.83,62.25 SV23.1 | SV22.1 6.14,54.61 6.25,54.5 | SV24.1 6.36,54.61 6.25,54.5 | 66.5,46 63.25,49.25 63.25,50.67 OK1.1 66.54,53.96 C6.2 | 61.5,16.25 77.25,16.25 78.34,15.16 U5.3
  Top 1.016: 66.5,46 67,45.5 67,43 v67.75,42.25 v69.5,42.25
  Top 1.25: SV21.1 87,54.61 87,54.75 86.75,54.75 | 86.75,54.75 86.75,62.25 | 86.75,54.75 86.75,47 84.25,44.5 84.25,44 | SV25.1 84.36,54.75 86.75,54.75 | D3.A 69.94,29.25 63,29.25 61,27.25 61,21 61.5,20.5 61.5,16.25 61.5,8.5 59.72,6.71 SV35.2
  Top 1.27: SV20.1 89.28,62.25 86.75,62.25 84.23,62.25 SV18.1
  Bottom 0.25: v45,34 45,34.5 v44,35.5
  Bottom 1: 18.5,7 24.25,7 25.5,5.75 27,5.75 | 18.5,7 18.25,7 16.54,5.29 SV35.19 | 27,5.75 44,5.75 46,7.75 46,10.5 48.25,12.75 52.75,12.75 56.5,9 59.25,9 59.72,8.54 SV35.2 | SV24.1 SV32.1 | SV18.1 83.5,62.95 83.5,63 77.5,69 13.25,69 12.7,68.45 SV36.5 12.75,65.99 12.75,64.25 13.97,63.03 SV31.1 | v69.5,42.25 v67.75,42.25 48.25,42.25 45,39 v45,38.75 v45,37.5 | 18.5,7 18.5,8.25 14,12.75 12.75,12.75 | D3.A 70.94,28.25 63,28.25 58.88,24.12 52.12,24.12 51.5,23.75 49.5,23.75 49,24.25 47.25,24.25 46.5,25 34.79,25 R29.1 | SV35.15 27,2.56 27,5.75 | R12.2 11.25,14.21 11.25,19 10.75,19.5 8.5,19.5 5.14,22.86 SV27.4
  pour Top (isolate 0.254, no thermals): 70.75,26.75 82.25,26.75 82.25,32.75 86.25,32.75 86.5,33 86.5,45.75 86.25,46 82,46 81.25,45.25 81.25,43.25 72.25,43.25 71.25,44.25 67,44.25 67,32.5 74.75,32.5 74.75,29 74.25,28.5 70.75,28.5
+5V_MOD
  pour Top (isolate 0.25, no thermals): 2.5,11 9.75,11 9.75,11.25 11,12.5 11,14.25 11.5,14.75 39,14.75 39,12.25 43.25,12.25 43.25,10.75 39.5,10.75 36.25,7.5 25.25,7.5 24,9 24,9.25 23,10.25 18.25,10.25 18,10.5 12,10.5 11,9.5 2.75,9.5 2.5,9.75
BATT_V_SENSE  (via drill 0.4)
  Top 0.25: v37.25,43.5 37.5,43.25 U4.91 | R2.1 R1.2
  Bottom 0.25: R1.2 50.54,48.75 41,48.75 39.5,47.25 39.5,44.25 38.5,43.25 37.5,43.25 v37.25,43.5
BTN_A  (via drill 0.4)
  Top 0.25: U4.83 41.5,43.75 42.12,44.38 42.38,44.38 42.88,44.88 42.88,46.88 42.5,47.25 27.75,47.25 27.5,47.5 27.5,48.25 v26.25,49.5
  Bottom 0.25: v26.25,49.5 26.25,46.12 25.62,45.5 19.75,45.5 18.75,46.5 18.75,47.5 18.25,48 17,48 16,47 J1.1
BTN_B  (via drill 0.4)
  Top 0.25: U4.15 33,33 34.75,34.75 34.75,35.75 35.5,36.5 36,36.5 38.25,34.25 v39,34.25
  Bottom 0.25: J2.1 76.39,44.25 47.21,44.25 42.75,39.79 42.75,37.5 39.5,34.25 v39,34.25
BTN_DN
  Top 0.25: U4.16 27.75,32.5 25.75,34.5 21.12,34.5 17.12,38.5 16.25,38.5 14.5,40.25 10.75,40.25 9.87,39.37 SV14.3
BTN_SEL
  Top 0.25: SV14.4 11.42,36.83 12.25,36 13.75,36 15.75,38 16.88,38 20.88,34 25.5,34 27.5,32 U4.17
BTN_UP
  Top 0.25: SV14.5 12.71,34.29 12.75,34.25 13.75,34.25 14.5,33.5 25.25,33.5 27.25,31.5 U4.18
GND  (via drill 0.4)
  Top 0.25: 36,27.25 U4.32 36,23.25 35.5,22.75 | U4.99 33.5,43.25 | 29.5,35.5 30,35 U4.11 32.5,35 | U4.81 42.5,43 42.75,43.25 | U4.62 46,33.5 45.75,33.75 45.75,34.75 45.25,35.25
  Top 1.016: 71,30.25 71.12,30.38
  other vias: 41.75,34.62 31.5,25.75 45.5,23 45.25,28.75 64.75,31 14.25,28.62 44.5,45.75 44.38,9.12 44.38,12.38 59.75,12 64.75,37.25 55.75,4.75 40.25,22.75 39,20.5 63.5,24.5 63.5,19.25
  pour Top (isolate 0.25, rank 3, no thermals): 0,70 93,70 93,0 0,0
  pour Bottom (rank 3, no thermals): -0.01,69.98 92.99,69.98 92.99,-0.01 -0.01,-0.01
KNOB_A
  Top 0.25: U4.93 36.5,44 35.25,45.25 23.25,45.25 22.5,46 C17.2 21.21,48.25 12,48.25 11.5,48.75 11.5,50.25 9.68,52.07 SV24.2
KNOB_B  (via drill 0.4)
  Top 0.25: U4.92 37,40 38.75,38.25 41.6,38.25 v41.8,38.45 | SV25.2 81.82,52.07 80.5,50.75 75,50.75 73.25,49 C18.2
  Bottom 0.25: v41.8,38.45 41.8,39.55 47,44.75 66.25,44.75 66.75,45.25 70,45.25 70.5,45.75 71.5,45.75 72.5,46.75 73.04,46.75 C18.2
LCD_BKLGHT  (via drill 0.4)
  Top 0.25: U4.6 25.25,37.5 v24.75,38 | v19.5,28.75 19.5,26.5 v16.25,23.25
  Bottom 0.25: R14.2 23.25,10.79 23.25,14.25 21.5,16 17.25,16 16.5,16.75 16.5,23.25 v16.25,23.25 | v19.5,28.75 20,28.75 21.5,30.25 21.5,33.75 24.25,36.5 24.25,37.5 v24.75,38
LCD_D0
  Top 0.25: U4.78 44,43.5 44.25,43.75 47.25,43.75 49.5,41.5 53,41.5 56,38.5 56,7.13 54.12,5.25 49,5.25 47.02,3.27 SV35.7
LCD_D1
  Top 0.25: U4.77 44.5,43 44.75,43.25 47,43.25 49.25,41 52.75,41 55.5,38.25 55.5,7.34 53.91,5.75 48.79,5.75 48.04,5 45.73,5 44.48,3.75 SV35.8
LCD_D2
  Top 0.25: U4.76 47.5,42 49,40.5 52.5,40.5 55,38 55,7.54 53.71,6.25 48.59,6.25 47.84,5.5 44.52,5.5 41.94,2.92 SV35.9
LCD_D3
  Top 0.25: U4.75 52.25,40 54.5,37.75 54.5,7.75 53.5,6.75 48.38,6.75 47.63,6 44.25,6 43.25,5 41.29,5 39.4,3.1 SV35.10
LCD_D4
  Top 0.25: U4.74 52,39.5 54,37.5 54,8 53.25,7.25 48.17,7.25 47.42,6.5 44,6.5 43,5.5 41.09,5.5 40.59,5 38.25,5 36.85,3.6 SV35.11
LCD_D5
  Top 0.25: U4.73 51.75,39 53.5,37.25 53.5,8.5 52.75,7.75 47.96,7.75 47.21,7 43.75,7 42.75,6 40.88,6 40.38,5.5 38,5.5 37.5,5 35,5 34.31,4.32 SV35.12
LCD_D6
  Top 0.25: U4.72 51.5,38.5 53,37 53,9 52.25,8.25 47.76,8.25 47.01,7.5 43.54,7.5 42.54,6.5 40.67,6.5 40.17,6 37.75,6 37.25,5.5 34.25,5.5 31.77,3.02 SV35.13
LCD_D7
  Top 0.25: U4.71 51.25,38 52.5,36.75 52.5,9.65 51.6,8.75 47.55,8.75 46.8,8 43.25,8 42.25,7 40.46,7 39.96,6.5 37.5,6.5 37,6 33.75,6 32.25,4.5 30.5,4.5 29.23,3.23 SV35.14
LCD_EN  (via drill 0.4)
  Top 0.25: U4.63 48.14,34 48.62,34.49 48.62,35.88 49,36.25 50.75,36.25 51,36 51,12 50.25,11.25 49.5,11.25 v48.5,10.25
  Bottom 0.25: v48.5,10.25 48.5,4.5 49.55,3.44 SV35.6
LCD_R/W  (via drill 0.4)
  Top 0.25: U4.70 51,37.5 52,36.5 52,10.25 v51.5,9.75
  Bottom 0.25: SV35.5 52.09,3.4 51.25,4.25 50.5,4.25 49.38,5.38 49.38,10.62 49.88,11.12 50.62,11.12 51.5,10.25 v51.5,9.75 54.5,6.75 R11.1
LCD_RS  (via drill 0.4)
  Top 0.25: U4.64 47.93,34.5 48.12,34.7 48.12,36.12 48.75,36.75 51,36.75 51.5,36.25 51.5,11.5 v50.25,10.25
  Bottom 0.25: v50.25,10.25 50.25,6.25 51.75,4.75 54,4.75 54.63,4.12 SV35.4
M_RX0  (via drill 0.4)
  Top 0.25: v22.74,39.51 23.01,39.49 23.02,39.5 U4.2 | v17.47,32.5 17.75,32.22 17.75,30.25 13,25.5 11.75,25.5 10.25,24 7.75,24 6.5,25.25 3.96,25.25 SV27.3
  Bottom 0.25: v17.47,32.5 17.5,32.5 18.25,33.25 19.5,33.25 22.74,36.49 v22.74,39.51 22.62,39.4
M_RX1
  Top 0.25: SV28.3 11.19,15 25.75,15 26,14.75 26,14 26.75,13.25 27.75,13.25 30.25,15.75 40.25,15.75 43.25,18.75 43.25,23 42.5,23.75 U4.45
M_RX2  (via drill 0.4 pad 0.61)
  Top 0.25: U4.12 29.75,34.5 29.5,34.75 v27.5,34.75 | v11,21.25 10.5,21.25 8.5,19.25 7.5,19.25 6.75,18.5 6.75,15 4.45,12.7 SV29.3
  Bottom 0.25: v27.5,34.75 27.5,32.5 30,30 30,26 29,25 23.75,25 23.12,24.38 12.38,24.38 11.25,23.25 11.25,21.5 v11,21.25
M_TX0  (via drill 0.4)
  Top 0.25: v23.5,38.53 23.97,39 U4.3 | v18.75,32.5 18.25,32 18.25,27.21 R21.1
  Bottom 0.25: v23.5,38.53 23.5,36.5 19.5,32.5 v18.75,32.5
M_TX1
  Top 0.25: R20.1 32.29,14.54 33,15.25 40.5,15.25 43.75,18.5 43.75,23.25 43,24 U4.46
M_TX2  (via drill 0.4 pad 0.61)
  Top 0.25: U4.13 v28.5,34
  Bottom 0.25: v28.5,34 28.5,32.25 30.5,30.25 30.5,25.75 29.25,24.5 24,24.5 21.75,22.25 18.75,22.25 17.79,23.21 R19.1
MISO  (via drill 0.4)
  Top 0.25: U4.22 29,29.5 v28.62,29.12 26.75,27.25 26.75,23.5 27,23.25 R29.2
  Bottom 0.25: SV15.1 25.4,31.35 27.75,29 28.5,29 v28.62,29.12 | R29.2 28,23.21 28,19.73 T4.3
MOSI
  Top 0.25: 25.75,28 24.75,28 | U4.21 27.96,30 26.75,28.79 | 24.75,28 23.54,29.21 SV15.4 | 24.75,21.25 R22.2 23.75,22.29 23.75,23.75 24.25,24.25 24.25,27.5 24.75,28
  Top 0.254: 26.75,28.79 25.96,28 25.75,28
N$1
  Top 0.25: R16.2 18.75,7.75 21.25,5.25 C12.1 R14.1
N$2
  Top 0.25: R12.1 17.5,12.75 17,12.25 17,9.25 18,8.25 18,7.5 19.88,5.62 19.88,4.62 21.61,2.88 SV35.17
  Bottom 0.25: R12.1 C10.1
N$3
  Top 1: R18.2 13.27,9.02 T2.3
N$4
  Top 0.25: T2.2 18.75,5.91 R16.1
N$5
  Top 0.25: C11.1 20.96,42 R13.1
  Bottom 0.25: R17.2 R13.1
N$6
  Top 0.25: R21.2 5,26.75 SV27.2
N$7
  Top 0.25: SV28.2 10.74,15.24 11,15.5 27,15.5 27.25,15.25 27.25,14.54 R20.2
N$8
  Top 0.25: R19.2 11.75,23.25 8.25,19.75 7.25,19.75 6.25,18.75 6.25,15.75 5.75,15.25 SV29.2
N$9
  Top 0.25: U4.33 36.5,21.08 Q1.2 36.46,20.29 37.79,18.96 C1.2
N$10
  Top 0.25: U4.34 37,24.75 40.25,21.5 41.08,21.5 Q1.1 41.54,18.58 C2.2
N$11
  Bottom 0.25: T4.1 31.27,19 47.75,19 49.25,17.5 53.75,17.5 56.75,14.5 60.25,14.5 63.25,17.5 76,17.5 76.7,16.8 U$1.7
N$12  (via drill 0.4)
  Top 0.25: OK1.4 55.92,50.5 60.5,50.5 66,45 66,40.25 v66.5,39.75
  Bottom 0.25: v66.5,39.75 67,40.25 83.5,40.25 84.25,39.5 84.25,35.25 87.75,31.75 88.5,31.75 91.25,29 91.25,13.5 90.45,12.7 SV1.3
N$15
  Top 1: SV35.20 13.99,3.21 R18.1
N$16
  Bottom 0.25: 17.7,17.16 R27.1 R24.2 21.5,17.25 23.75,15 26,15 26.62,15.62 28.62,15.62 31,13.25 33.25,13.25 35.62,15.62 43.88,15.62 44.25,15.25 53.75,15.25 56,13 61,13 64,16 67.25,16 69.25,14 71,14 71.25,14.25 71.25,15.11 U$1.2
N$17
  Bottom 0.25: R26.1 R22.1 19.71,21.04 21,19.75 21,18.5 24,15.5 25.75,15.5 26.38,16.12 30.62,16.12 31.12,15.62 34.88,15.62 35.38,16.12 44.12,16.12 44.5,15.75 54,15.75 56.25,13.5 60.75,13.5 63.75,16.5 72,16.5 72.31,16.2 U$1.3
N$18  (via drill 0.4)
  Top 0.25: R23.2 v22.25,19.25
  Bottom 0.25: R23.2 R25.1 | U$1.5 74.5,16.75 74.25,17 63.5,17 60.5,14 56.5,14 53.5,17 49,17 47.5,18.5 32,18.5 31.62,18.12 27.62,18.12 25.5,16 24.25,16 22.5,17.75 22.5,19 v22.25,19.25
N$19
  Bottom 0.25: T4.2 29.91,21 30.75,21 32.25,19.5 48,19.5 49.5,18 54.79,18 R28.1
N$20
  Bottom 0.25: R17.1 16.18,36.78 T3.2
N$21
  Bottom 0.406: D2.A 15.24,30.48 | 15.24,30.48 14.61,30.48 12.06,27.94 SV30.2 | T3.3 15.24,30.48
N$22
  Top 0.406: D2.C 12.7,30.98 R15.2
  Bottom 0.406: SV30.1 D2.C
N$29
  Top 0.406: T1.2 83.75,21.26 82.01,23 R6.1
N$30
  Top 0.406: D1.C 90,30.5 91.5,29 91.5,26.5 90.5,25.5 89.39,25.5 SV16.2 88.69,25.4 R6.2
N$38
  Top 0.25: OK1.3 55.67,53.25 52,53.25 51.25,54 R1.1
N$39
  Top 1: R7.2 C4.2 86.25,10.04 86.25,11.25 86.75,11.75 86.75,13.75 88.24,15.24 SV1.4 | Q2.2 72.8,22.7 71.75,23.75 69.04,23.75 SV17.3
  Bottom 1: R4.2 81.25,20.46 81.25,17.75
  Bottom 1.422: SV1.5 SV1.4
  Bottom 2: SV1.5 89.27,17.75 81.25,17.75 79.5,17.75 77.75,19.5 75,19.5 70.21,24.29 SV17.3
N$43
  Top 0.25: R7.1 C4.1 82.48,11.27 T1.3 81.75,13.98 81.75,16.5 79.5,18.75 73.75,18.75 | 73.75,18.75 68.96,18.75 SV17.1 | Q2.1 73.75,20.65 73.75,18.75
N$44
  Top 0.25: R3.2 62.04,54.54 OK1.2
N$45
  Top 0.406: R4.1 87,20.5 89.3,22.8 SV16.3
N$47  (via drill 0.4)
  Top 1: Q2.3 SV17.2
  Top 1.25: v49,22.25 47.25,22.25 v47.25,21.25 47.25,15.5 45.56,13.81 U3.3 | 77.62,25.62 77.33,25.32 71.12,25.32 69.52,26.93 66.93,26.93 65.75,25.75 65.75,23 67,21.75 SV17.2 | 77.62,25.62 77.75,25.75 | C5.+ 78.77,24.48 77.62,25.62 | U2.3 77.56,27.75 | 77.56,27.75 77.56,25.69 77.62,25.62 | D3.C 77.56,27.75
  Bottom 1.25: v47.25,21.25 47.25,22.25 v49,22.25 51.75,22.25 52.5,22.75 64.25,22.75 65.25,21.75 SV17.2
POW_LATCH  (via drill 0.4)
  Top 0.25: U4.26 33,27 33.5,27.5 35,27.5 v35.7,28.2
  Bottom 0.25: v35.7,28.2 36.49,28.2 37.47,27.22 45.68,27.22 46.53,28.07 46.53,28.89 48.28,30.64 48.28,35.86 47.76,36.38 47.76,38.14 49.37,39.75 64.25,39.75 65.62,38.38 67.12,38.38 68,39.25 83,39.25 83.25,39 83.25,32.25 81.5,30.5 D1.A
POW_OFF  (via drill 0.4)
  Top 0.25: U4.25 34.5,28 34.75,28.25 34.75,29 35.25,29.5 35.6,29.5 v35.62,29.52
  Top 0.406: R5.1 88.73,27.94 SV16.1
  Bottom 0.25: v35.62,29.52 35.98,29.52 37.78,27.72 45.47,27.72 46.03,28.28 46.03,29.1 47.78,30.85 47.78,35.65 47.26,36.17 47.26,38.34 49.16,40.25 64.62,40.25 66,38.88 66.88,38.88 67.75,39.75 83.25,39.75 83.75,39.25 83.75,35 86.25,32.5 86.25,29.75 87.75,28.25 88.98,28.25 SV16.1
RESET  (via drill 0.4)
  Top 0.25: U4.30 35,24.5 34.88,24.38 30.38,24.38 29,23 29,22.75 28.25,22 27.75,22 27,22.75 26.75,22.75 26.25,23.25 26.25,25.82 SV15.5
  Top 0.406: R8.1 19.71,25.04 v19.5,25.25
  Bottom 0.25: SV15.5 24.67,26.67 23,25 19.75,25 v19.5,25.25 19.12,24.88 11.88,24.88 11.25,25.5 11.25,26.25 10.75,26.75 7.5,26.75 6.75,27.5 6.75,28.5 4.75,30.5 3.83,30.5 SV27.1
SCK
  Top 0.25: U4.20 27.75,30.5 26.46,29.21 SV15.3 24.11,30.5 22.5,30.5 21,29 21,24.25 21.25,24 21.25,21.5 22,20.75 22.75,20.75 24.25,19.25 R23.1
SCL  (via drill 0.4)
  Top 0.25: v31,43.25 27.5,43.25 v26.75,42.5 | U4.43 41.5,27.25 43.5,29.25 43.5,31.75 42.5,32.75 37.25,32.75 36.5,32 36.5,31.75 v35.5,30.75 | U1.6 34.12,52.63 33.25,53.5 31.29,53.5 R9.2 29.21,54.54 20.5,63.25 19.5,63.25 17.75,65 17.75,66.01 SV36.3
  Bottom 0.25: v26.75,42.5 27.25,42 27.25,37.13 30.75,33.62 32.88,33.62 35.5,31 v35.5,30.75 | v31,43.25 31,43.5 31.5,44 31.5,48.5 31.38,48.62 31.38,52.25 30.25,53.38 R9.2
SDA  (via drill 0.4)
  Top 0.25: v31,41.75 30.5,41.25 v26.47,41.25 | U4.44 42,27 44,29 44,32 42.75,33.25 36.5,33.25 34.38,31.12 v34.25,31.12 | 35.5,54.05 U1.5 35.55,54 33.75,54 33.21,54.54 R10.2 31.96,54.54 30.75,55.75 28.75,55.75 20.75,63.75 19.75,63.75 19,64.5 19,67.5 18.5,68 16.25,68 15.25,67 SV36.4
  Bottom 0.25: v26.47,41.25 26.47,40.53 26.75,40.25 26.75,36.92 30.55,33.12 32.62,33.12 34.25,31.5 v34.25,31.12 | v31,41.75 32,42.75 32,46.5 34,48.5 34,53.04 R10.2
SPKR
  Top 0.25: U4.7 23,37 19.75,40.25 16.25,40.25 14.5,42 R13.2
SS
  Top 0.25: U4.19 26.5,31 26,30.5 25,30.5 24.25,31.25 24.25,32.25 23.5,33 22.25,33 21.5,32.25 21.5,30.25 20.5,29.25 20.5,24 20.75,23.75 20.75,21.25 21.75,20.25 22.5,20.25 23.25,19.5 23.25,19.25 24.79,17.71 R24.1
SWA_DN  (via drill 0.4)
  Top 0.25: SV2.1 35.56,63.5 44.25,63.5 45,62.75 45,47.41 49.91,42.5 53.41,42.5 57,38.91 57,29.5 v57.75,28.75 | v49.5,28.75 49.5,29.22 48.72,29.22 48.44,29.5 U4.54
  Bottom 0.25: v49.5,28.75 v57.75,28.75
SWA_UP  (via drill 0.4)
  Top 0.25: SV2.3 28,65.98 28,65.25 29.5,63.75 34.25,63.75 35,63 44,63 44.5,62.5 44.5,47.21 49.71,42 53.21,42 56.5,38.71 56.5,28.25 v57,27.75 | v50.25,27.75 49.4,27.75 48.51,28.64 48.51,28.72 48.23,29 U4.53
  Bottom 0.25: v50.25,27.75 v57,27.75
SWB_DN  (via drill 0.4)
  Top 0.25: SV3.1 46,63.22 46,47.83 50.33,43.5 53.83,43.5 58,39.33 58,31 58.28,30.72 59.28,30.72 v59.75,30.25 | U4.56 v49.25,30.5
  Bottom 0.25: v49.25,30.5 49.28,30.53 50.28,30.53 50.5,30.75 58,30.75 58.03,30.72 58.75,30.72 59.22,30.25 v59.75,30.25
SWB_UP  (via drill 0.4)
  Top 0.25: SV3.3 38,65.94 38,65 39,64 44.5,64 45.5,63 45.5,47.62 50.12,43 53.62,43 57.5,39.12 57.5,30 57.75,29.75 v58.5,29.75 | v50.25,29.75 49.6,29.75 49.57,29.72 48.93,29.72 48.65,30 U4.55
  Bottom 0.25: v58.5,29.75 v50.25,29.75
SWC_DN  (via drill 0.4)
  Top 0.25: SV4.1 55.88,64.88 55,64 47.5,64 47,63.5 47,48.25 50.75,44.5 54.24,44.5 59,39.74 59,33.25 59.5,32.75 v59.75,32.75 | v49.75,32.75 48.5,31.5 U4.58
  Bottom 0.25: v59.75,32.75 v49.75,32.75
SWC_UP  (via drill 0.4)
  Top 0.25: SV4.3 49.26,64.5 47.25,64.5 46.5,63.75 46.5,48.04 50.54,44 54.04,44 58.5,39.54 58.5,32 59,31.5 v59.25,31.5 | v50,31.5 49.21,31.5 48.71,31 U4.57
  Bottom 0.25: v59.25,31.5 v50,31.5
SWD_DN  (via drill 0.4)
  Top 0.25: SV5.1 66.04,64.79 65,63.75 61.21,63.75 60.46,63 48.25,63 48,62.75 48,48.66 51.16,45.5 54.66,45.5 60,40.16 60,35.75 60.5,35.25 v60.75,35.25 | v49.5,35.25 49.12,34.88 49.12,34.28 48.25,33.41 48.25,32.75 48,32.5 U4.60
  Bottom 0.25: v49.5,35.25 v60.75,35.25
SWD_UP  (via drill 0.4)
  Top 0.25: SV5.3 60.96,64.46 60,63.5 47.75,63.5 47.5,63.25 47.5,48.46 50.96,45 54.45,45 59.5,39.95 59.5,34.25 59.75,34 v60.25,34 | v50,34 49.5,33.5 49.05,33.5 48.75,33.2 48.75,32.54 48.21,32 U4.59
  Bottom 0.25: v50,34 v60.25,34
SWE_DN  (via drill 0.4)
  Top 0.25: U4.24 32.75,28.5 33,28.75 33,31 35,33 35.5,33 v36.75,34.25
  Bottom 0.25: SV6.1 36,57.98 36,47.25 34.5,45.75 34.5,41.5 32.25,39.25 32.25,38.75 33,38 34.5,38 36.75,35.75 v36.75,34.25
SWE_UP  (via drill 0.4)
  Top 0.25: U4.23 32.25,29 32.5,29.25 32.5,31.5 34.75,33.75 35.25,33.75 35.75,34.25 v35.75,35.5
  Bottom 0.25: SV6.3 27.94,59.56 29,58.5 34.25,58.5 35.5,57.25 35.5,47.5 34,46 34,41.75 31.75,39.5 31.75,38.5 32.75,37.5 34.25,37.5 35.75,36 v35.75,35.5
SWF_DN  (via drill 0.4)
  Top 0.25: v48.75,27.25 48.25,27.75 48.25,28.19 47.94,28.5 U4.52 | v48.75,59.5 48.75,59 49.53,58.22 49.53,57.28 49,56.75 49,49.08 51.58,46.5 55.07,46.5 61,40.57 61,36.96 62.03,35.93 62.03,33.82 61.03,32.82 61.03,29.72 60.28,28.97 59.68,28.97 59.03,28.32 59.03,27.28 v59,27.25
  Bottom 0.25: v48.75,27.25 49.5,27.25 50,26.75 56,26.75 56.22,26.97 58.72,26.97 v59,27.25 | SV7.1 44.64,59.5 v48.75,59.5
SWF_UP  (via drill 0.4)
  Top 0.25: U4.51 48,27 48,26.75 v48.75,26 | v48.75,57.75 48.75,57.25 48.5,57 48.5,48.87 51.37,46 54.86,46 60.5,40.36 60.5,37.25 60.5,36.75 61.53,35.72 61.53,34.03 60.53,33.03 60.53,29.93 60.07,29.47 59.47,29.47 58.53,28.53 58.53,28.18 57.25,26.9 v57.25,26
  Bottom 0.25: v48.75,26 49.5,26 49.75,26.25 57,26.25 v57.25,26 | SV7.3 40.31,58.75 47.75,58.75 v48.75,57.75
SWG_DN  (via drill 0.4)
  Top 0.25: U4.82 42,43.25 43.5,44.75 43.5,47.25 44,47.75 44,55.75 v43.75,56
  Bottom 0.25: SV8.1 55.88,60.63 51.5,56.25 44,56.25 v43.75,56
SWG_UP  (via drill 0.4)
  Top 0.25: U4.90 38,43 38.25,43.25 v38.25,45
  Bottom 0.25: SV8.3 50.8,58.55 49,56.75 43,56.75 42.5,56.25 42.5,50 42.25,49.75 40.5,49.75 38.5,47.75 38.5,45.25 v38.25,45
SWH_DN  (via drill 0.4)
  Top 0.25: U4.50 47.5,26 48.28,25.22 49.97,25.22 v50,25.25 | SV9.1 66,60.92 66,59.75 64.5,58.25 56.75,58.25 55.25,56.75 50,56.75 49.5,56.25 49.5,49.29 51.79,47 55.28,47 61.5,40.78 61.5,37.16 62.53,36.14 62.53,33.61 61.53,32.61 61.53,29.51 59.78,27.76 59.78,26.93 58.25,25.4 v58.25,25.25
  Bottom 0.25: v50,25.25 56,25.25 56.25,25 58,25 v58.25,25.25
SWH_UP  (via drill 0.4)
  Top 0.25: U4.5 32.75,38 33,38.25 33,38.75 v33.25,39
  Bottom 0.25: SV9.3 58.96,60.96 56.75,58.75 54.75,58.75 51.75,55.75 44.75,55.75 43,54 43,49.5 42.75,49.25 40.75,49.25 39,47.5 39,44.5 38.5,44 38,44 37.5,44.5 37,44.5 36.25,43.75 36.25,43 36.75,42.5 36.75,40.75 35,39 v33.25,39
TRIM_X1_DN  (via drill 0.4)
  Top 0.25: U4.35 37.5,27.04 37.22,27.32 37.22,30.72 37.5,31 37.5,31.75 v37.53,31.78
  Bottom 0.25: SV13.1 5.65,41.91 5.99,42.25 5.99,45.34 7.24,46.59 10.41,46.59 12.5,44.5 27.66,44.5 28.75,43.41 28.75,37.75 31.38,35.12 33.67,35.12 37.02,31.77 37.03,31.78 v37.53,31.78
TRIM_X1_UP  (via drill 0.4)
  Top 0.25: U4.36 38,27.25 37.72,27.53 37.72,29.72 38.25,30.25 38.5,30.25 39,30.75 v39,31.75
  Bottom 0.25: SV13.3 3.91,47.09 10.66,47.09 12.75,45 27.87,45 29.25,43.62 29.25,38 31.62,35.62 33.88,35.62 36.75,32.75 38,32.75 v39,31.75
TRIM_X2_DN  (via drill 0.4)
  Top 0.25: U4.41 40.5,27.75 42.5,29.75 42.5,30.75 v42.25,31
  Bottom 0.25: SV10.1 71.34,41.91 70,43.25 47.62,43.25 43.83,39.46 43.83,37.12 44.18,36.78 44.53,36.78 46.28,35.03 46.28,31.47 45.53,30.72 44.11,30.72 43.59,31.25 42.5,31.25 v42.25,31
TRIM_X2_UP  (via drill 0.4)
  Top 0.25: U4.42 41,27.5 43,29.5 43,31.5 42.5,32 41.5,32 v41.25,31.75
  Bottom 0.25: 88.5,47 89.28,47 SV10.3 81.49,46.99 80.25,45.75 78.75,45.75 76.75,43.75 47.41,43.75 43.33,39.67 43.33,36.92 43.97,36.28 44.32,36.28 45.78,34.82 45.78,31.68 45.32,31.22 44.32,31.22 43.67,31.88 41.38,31.88 v41.25,31.75
TRIM_Y1_DN  (via drill 0.4)
  Top 0.25: U4.37 v38.5,29.25
  Bottom 0.25: SV12.1 5.54,34.29 7,35.75 7,36.35 6.99,36.36 7,36.37 7,40.25 7.5,40.75 10.5,40.75 13.25,43.5 27.25,43.5 27.75,43 27.75,37.34 30.96,34.12 33.25,34.12 37.13,30.25 37.75,30.25 38.5,29.5 v38.5,29.25
TRIM_Y1_UP  (via drill 0.4)
  Top 0.25: U4.38 39,28.5 39.38,28.88 39.38,29.88 40,30.5 40,30.62 v40.25,30.88
  Bottom 0.25: SV12.3 6.36,39.37 6.49,39.5 6.49,41.99 7.75,43.25 11.5,43.25 12.25,44 27.46,44 28.25,43.21 28.25,37.54 31.17,34.62 33.46,34.62 37.34,30.75 | 37.25,30.75 37.34,30.75 | v40.25,30.88 40.12,30.75 37.75,30.75 37.34,30.75
TRIM_Y2_DN  (via drill 0.4)
  Top 0.25: U4.39 39.5,28.25 40.25,29 v40.25,29.5
  Bottom 0.25: SV11.1 87.96,34.29 85.75,36.5 85.75,39.5 84.5,40.75 48.96,40.75 46.76,38.55 46.76,35.96 47.28,35.44 47.28,31.06 45.94,29.72 42.28,29.72 42.28,29.68 41.82,29.22 41.18,29.22 40.9,29.5 v40.25,29.5
TRIM_Y2_UP  (via drill 0.4)
  Top 0.25: U4.40 40,28 41.25,29.25 41.25,29.75 v41.5,30
  Bottom 0.25: SV11.3 86.88,39.37 85,41.25 48.75,41.25 46.26,38.76 46.26,35.76 46.78,35.24 46.78,31.26 45.74,30.22 41.72,30.22 v41.5,30
X1_AXIS
  Top 0.25: U4.94 36,43.75 35,44.75 20.25,44.75 20,45 C16.2
  Bottom 0.25: C16.2 18.46,48.5 16.75,48.5 16.5,48.25 12.75,48.25 12.5,48.5 11.75,48.5 11.25,49 11.25,50 10.5,50.75 7.75,50.75 7,51.5 7,53.25 6.25,54 6.25,58.25 4.88,59.62 3.88,59.62 SV23.2
X2_AXIS  (via drill 0.4)
  Top 0.25: U4.97 34.5,40.75 36.25,39 36.5,39 38.5,37 39.25,37 v39.37,36.88
  Bottom 0.25: v39.37,36.88 39.37,38.62 46.5,45.75 65.75,45.75 66.96,46.96 C13.2 68.25,48.25 70.25,50.25 73.25,50.25 74.5,51.5 74.5,55 75.25,55.75 77.5,55.75 77.75,56 80.75,56 81,56.25 81,56.75 82.75,58.5 85.75,58.5 86.94,59.69 SV20.2
X3_AXIS
  Top 0.25: U4.86 40,46.5 39.75,46.75 27.25,46.75 27,47 27,47.75 26.25,48.5 24.75,48.5 23,50.25 19,50.25 18.75,50.5 18.75,56.21 17.96,57 | 17.96,57 17.25,57 15,59.25 14.41,59.25 SV31.2 | 17.96,57 C20.2
X4_AXIS  (via drill 0.4)
  Top 0.25: U4.84 41,45 41.25,45.25 v42,45.25 | C22.2 74.29,58 76.5,58 78.19,59.69 SV33.2
  Bottom 0.25: C22.2 72.75,58.54 72.75,56.75 72,56 71,56 69.5,54.5 69.5,51 65.25,46.75 43.25,46.75 43,46.5 43,45.75 42.5,45.25 v42,45.25
Y1_AXIS
  Top 0.25: U4.95 35.5,43.5 34.75,44.25 17.75,44.25 17.5,44.5 C15.2
  Bottom 0.25: 17.29,46.75 C15.2 16.29,45.75 12.75,45.75 10.75,47.75 7.75,47.75 6,49.5 6,50.5 4.5,52 3.88,52 SV22.2
Y2_AXIS  (via drill 0.4)
  Top 0.25: U4.96 35,41 36.5,39.5 36.75,39.5 38.5,37.75 40.25,37.75 v40.55,37.45
  Bottom 0.25: v40.55,37.45 40.55,39.05 46.75,45.25 66,45.25 66.5,45.75 69.54,45.75 C14.2 70.75,49.25 71.25,49.75 73.75,49.75 74.75,50.75 76.5,50.75 77,51.25 77,52.75 77.5,53.25 80.25,53.25 82.75,55.75 86,55.75 86.5,55.25 86.5,54.25 88.68,52.07 SV21.2
Y3_AXIS
  Top 0.25: U4.87 39.5,46 39.25,46.25 27,46.25 26.5,46.75 26.5,47.5 26,48 24.5,48 23,49.5 18,49.5 15.38,52.12 | C21.2 17.21,53.96 15.38,52.12 | 15.38,52.12 15.25,52 14.04,52 SV32.2
Y4_AXIS  (via drill 0.4)
  Top 0.25: C23.2 74.96,46.96 73.5,45.5 73,45.5 72,46.5 72,49.25 70.75,50.5 v67.75,50.5 | U4.85 40.5,46.25 40.75,46.5 v42,46.5
  Bottom 0.25: v67.75,50.5 67.75,50 65,47.25 42.75,47.25 v42,46.5 | C23.2 75.75,49.5 76.25,50 76.5,50 78.57,52.07 SV34.2
Z1_AXIS
  Top 0.25: U4.88 39,45.5 38.75,45.75 25.5,45.75 25,46.25 C8.1 24.79,46.96 23,48.75 17.75,48.75 15.75,50.75 12.5,50.75 11.25,52 11.25,58.5 10,59.75 8.95,59.75 SV19.2
Z2_AXIS  (via drill 0.4)
  Top 0.25: U4.89 38.5,40.75 v39,40.25
  Bottom 0.25: v39,40.25 40.25,40.25 46.25,46.25 65.5,46.25 70,50.75 71.5,50.75 72,51.25 72,54.5 73.5,56 73.5,56.79 C9.2 76.29,58.5 82,58.5 83.19,59.69 SV18.2

### Text on the board
bPlace: Design by / BUK7456 | Spkr
tNames: S | D | G | LCD
bNames: Gnd | 5V | SDA | SCL | SwA | SwB | SwC | SwD | Dn / Gnd / Up | 5V | 5V | 5V | 5V | 5V | 5V | X1 | Z1 | X3 | X4 | Z2 | X2 | Gnd | Gnd | Gnd | Gnd | Gnd | Gnd | SwE | SwF | SwG | SwH | 5V | 5V | 5V | 5V | 5V | 5V | Y1 | KbA | KbB | Y3 | Y4 | Y2 | Gnd | Gnd | Gnd | Gnd | Gnd | Gnd | Up | B | Up | TrimX1 | A | TrimX2 | Gnd | Gnd | Gnd | Dn | Dn | Up | TrimY1 | Dn | TrimY2 | Up | Gnd | Sel | Gnd | Dn | Up | Dn | Rst | Tx0 | + | - | PwrSw | Rx0 | Nc | 5V | Gnd | 7-12V | V_in | Tx2 | Rx2 | Tx1 | Rx1 | Vbat | 5V | 5V | Gnd | Gnd | Gnd